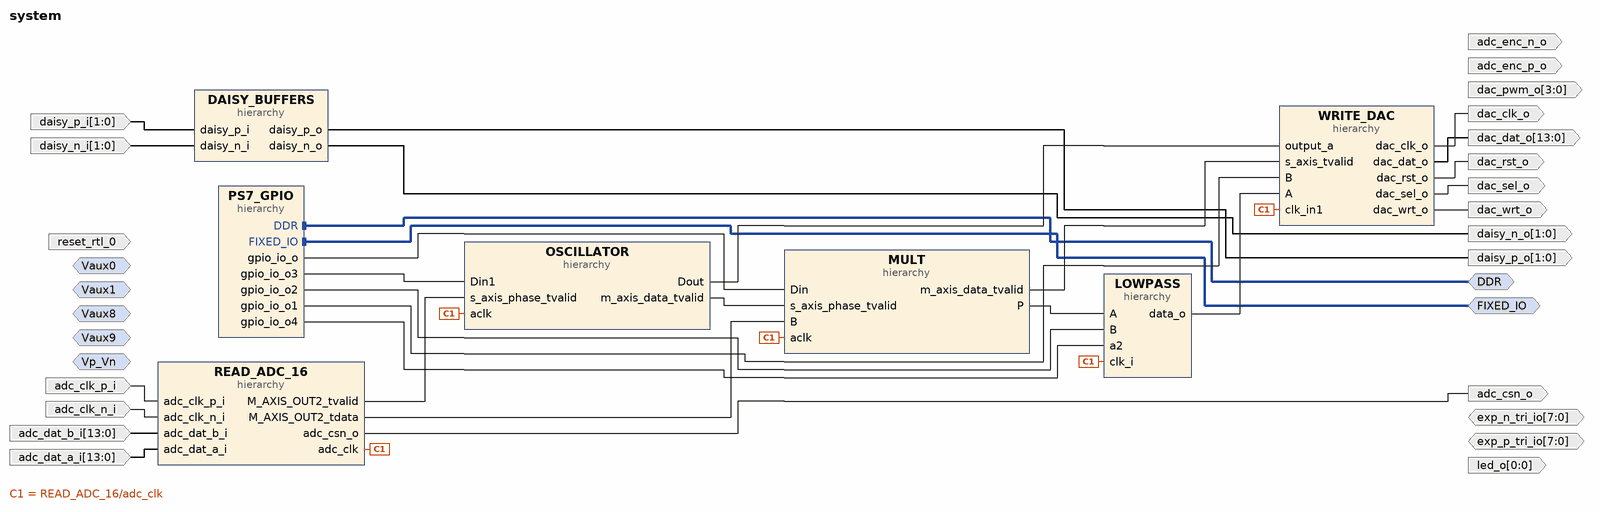
[diagram p0: block diagram of the top level]
# Vivado block design system, xc7z010clg400-1, Vivado 2018.2
create_bd_design system

create_bd_intf_port -mode Master -vlnv xilinx.com:interface:ddrx_rtl:1.0 DDR
create_bd_intf_port -mode Master -vlnv xilinx.com:display_processing_system7:fixedio_rtl:1.0 FIXED_IO
create_bd_intf_port -mode Slave -vlnv xilinx.com:interface:diff_analog_io_rtl:1.0 Vp_Vn
create_bd_intf_port -mode Slave -vlnv xilinx.com:interface:diff_analog_io_rtl:1.0 Vaux0
create_bd_intf_port -mode Slave -vlnv xilinx.com:interface:diff_analog_io_rtl:1.0 Vaux1
create_bd_intf_port -mode Slave -vlnv xilinx.com:interface:diff_analog_io_rtl:1.0 Vaux9
create_bd_intf_port -mode Slave -vlnv xilinx.com:interface:diff_analog_io_rtl:1.0 Vaux8
create_bd_port -dir O adc_enc_p_o
create_bd_port -dir O adc_enc_n_o
create_bd_port -dir O -from 3 -to 0 dac_pwm_o
create_bd_port -dir IO -from 7 -to 0 exp_p_tri_io
create_bd_port -dir IO -from 7 -to 0 exp_n_tri_io
create_bd_port -dir I -type rst reset_rtl_0
set_property -dict {CONFIG.POLARITY ACTIVE_HIGH} [get_bd_ports reset_rtl_0]
create_bd_port -dir O -from 0 -to 0 led_o
create_bd_port -dir I adc_clk_p_i
create_bd_port -dir I adc_clk_n_i
create_bd_port -dir I -from 1 -to 0 daisy_p_i
create_bd_port -dir I -from 1 -to 0 daisy_n_i
create_bd_port -dir O -from 1 -to 0 daisy_p_o
create_bd_port -dir O -from 1 -to 0 daisy_n_o
create_bd_port -dir O dac_clk_o
create_bd_port -dir O dac_rst_o
create_bd_port -dir O dac_sel_o
create_bd_port -dir O dac_wrt_o
create_bd_port -dir O -from 13 -to 0 dac_dat_o
create_bd_port -dir I -from 13 -to 0 adc_dat_b_i
create_bd_port -dir I -from 13 -to 0 adc_dat_a_i
create_bd_port -dir O adc_csn_o

create_bd_cell -type hier WRITE_DAC
create_bd_cell -type hier DAISY_BUFFERS
create_bd_cell -type hier PS7_GPIO
create_bd_cell -type hier READ_ADC_16
create_bd_cell -type hier MULT
create_bd_cell -type hier LOWPASS
create_bd_cell -type hier OSCILLATOR

# ---- hierarchy /WRITE_DAC ----
current_bd_instance /WRITE_DAC
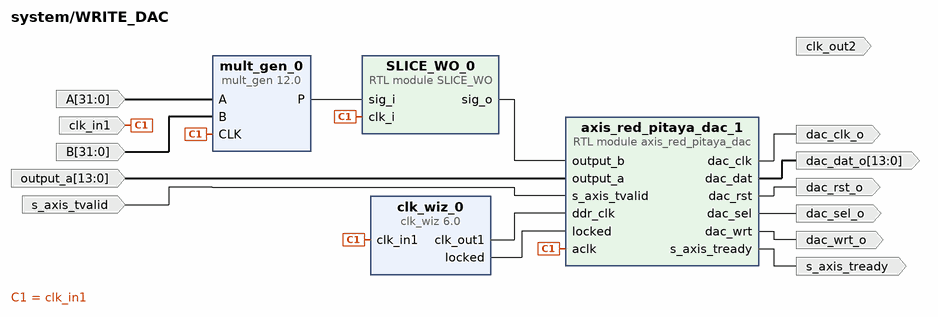
[diagram p1: block diagram inside /WRITE_DAC]
create_bd_pin -dir O -type clk dac_clk_o
create_bd_pin -dir O -type rst dac_rst_o
create_bd_pin -dir O dac_sel_o
create_bd_pin -dir O dac_wrt_o
create_bd_pin -dir O -from 13 -to 0 dac_dat_o
create_bd_pin -dir O s_axis_tready
create_bd_pin -dir I -from 13 -to 0 output_a
create_bd_pin -dir I s_axis_tvalid
create_bd_pin -dir O -type clk clk_out2
create_bd_pin -dir I -type clk clk_in1
create_bd_pin -dir I -from 31 -to 0 -type data A
create_bd_pin -dir I -from 31 -to 0 -type data B

create_bd_cell -type ip -vlnv xilinx.com:ip:clk_wiz:6.0 clk_wiz_0
set_property -dict [list \
  CONFIG.CLKOUT1_USED true \
  CONFIG.CLKOUT2_USED false \
  CONFIG.NUM_OUT_CLKS 1 \
  CONFIG.CLKOUT1_REQUESTED_OUT_FREQ 200 \
  CONFIG.CLKOUT2_REQUESTED_OUT_FREQ 200 \
  CONFIG.MMCM_DIVCLK_DIVIDE 1 \
  CONFIG.MMCM_CLKFBOUT_MULT_F 10.000 \
  CONFIG.MMCM_CLKOUT0_DIVIDE_F 5.000 \
  CONFIG.MMCM_CLKOUT1_DIVIDE 1 \
  CONFIG.CLKOUT1_JITTER 114.829 \
  CONFIG.CLKOUT1_PHASE_ERROR 98.575 \
  CONFIG.CLKOUT2_JITTER 209.588 \
  CONFIG.CLKOUT2_PHASE_ERROR 98.575 \
] [get_bd_cells clk_wiz_0]
create_bd_cell -type module -reference axis_red_pitaya_dac axis_red_pitaya_dac_1
create_bd_cell -type module -reference SLICE_WO SLICE_WO_0
create_bd_cell -type ip -vlnv xilinx.com:ip:mult_gen:12.0 mult_gen_0
set_property -dict [list \
  CONFIG.PortAType Signed \
  CONFIG.PortAWidth 32 \
  CONFIG.PortBType Signed \
  CONFIG.PortBWidth 32 \
  CONFIG.Multiplier_Construction Use_Mults \
  CONFIG.Use_Custom_Output_Width false \
  CONFIG.PipeStages 6 \
] [get_bd_cells mult_gen_0]

# ---- hierarchy /DAISY_BUFFERS ----
current_bd_instance /DAISY_BUFFERS
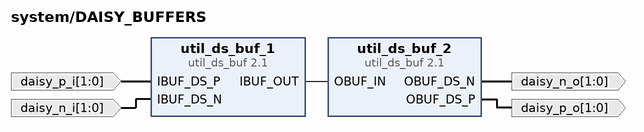
[diagram p2: block diagram inside /DAISY_BUFFERS]
create_bd_pin -dir I -from 1 -to 0 -type clk daisy_p_i
create_bd_pin -dir I -from 1 -to 0 -type clk daisy_n_i
create_bd_pin -dir O -from 1 -to 0 -type clk daisy_p_o
create_bd_pin -dir O -from 1 -to 0 -type clk daisy_n_o

create_bd_cell -type ip -vlnv xilinx.com:ip:util_ds_buf:2.1 util_ds_buf_1
set_property -dict {CONFIG.C_SIZE 2} [get_bd_cells util_ds_buf_1]
create_bd_cell -type ip -vlnv xilinx.com:ip:util_ds_buf:2.1 util_ds_buf_2
set_property -dict {CONFIG.C_SIZE 2 CONFIG.C_BUF_TYPE OBUFDS} [get_bd_cells util_ds_buf_2]

# ---- hierarchy /PS7_GPIO ----
current_bd_instance /PS7_GPIO
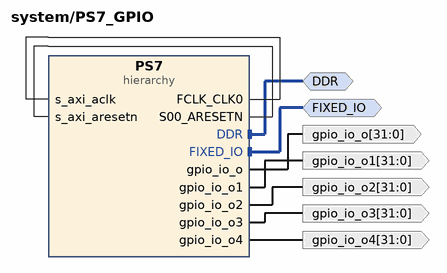
[diagram p3: block diagram inside /PS7_GPIO]
create_bd_intf_pin -mode Master -vlnv xilinx.com:interface:ddrx_rtl:1.0 DDR
create_bd_intf_pin -mode Master -vlnv xilinx.com:display_processing_system7:fixedio_rtl:1.0 FIXED_IO
create_bd_pin -dir O -from 31 -to 0 gpio_io_o
create_bd_pin -dir O -from 31 -to 0 gpio_io_o1
create_bd_pin -dir O -from 31 -to 0 gpio_io_o2
create_bd_pin -dir O -from 31 -to 0 gpio_io_o3
create_bd_pin -dir O -from 31 -to 0 gpio_io_o4

create_bd_cell -type hier PS7

# ---- hierarchy /PS7_GPIO/PS7 ----
current_bd_instance /PS7_GPIO/PS7
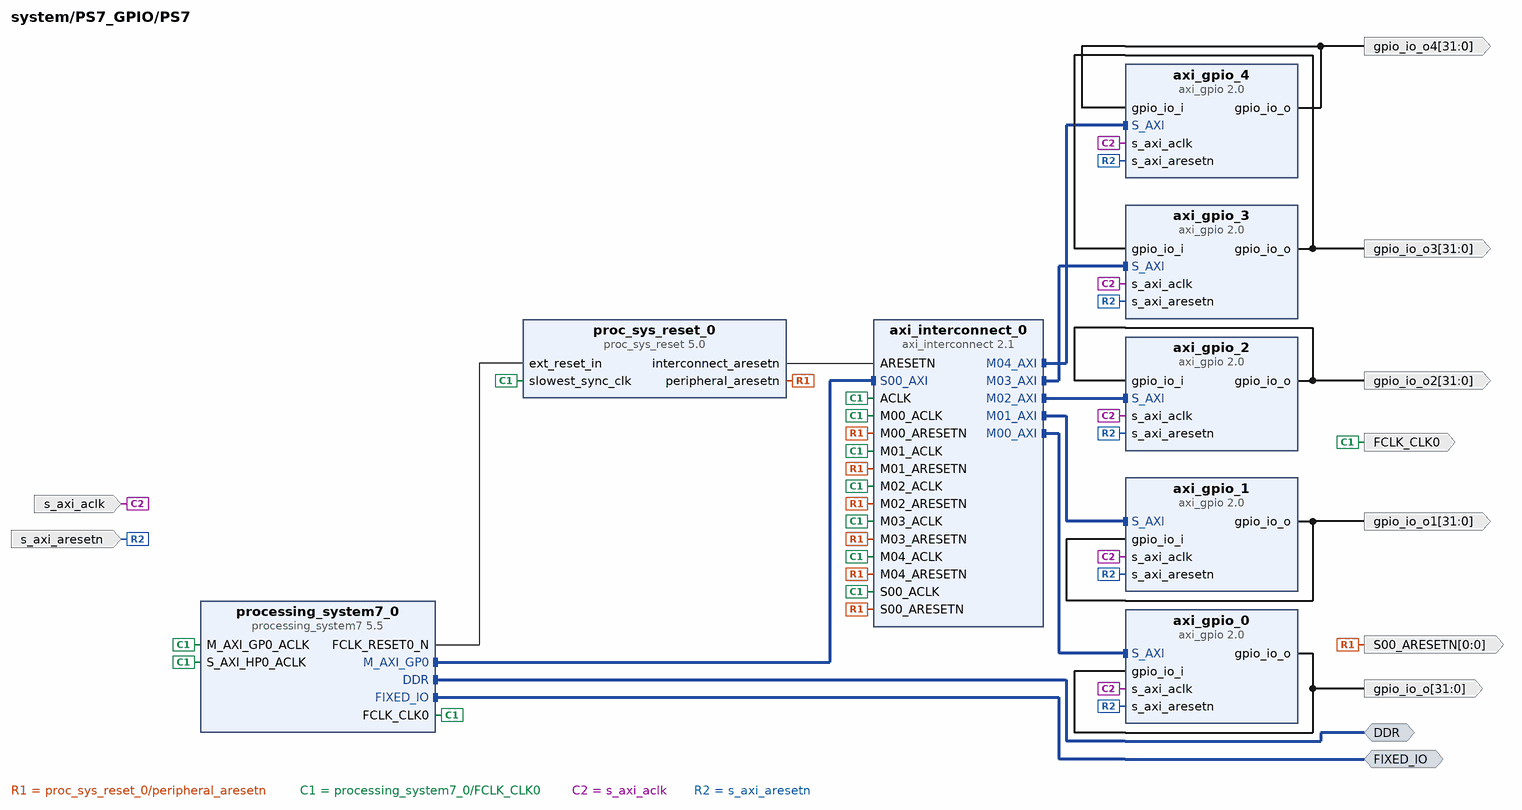
[diagram p4: block diagram inside /PS7_GPIO/PS7]
create_bd_intf_pin -mode Master -vlnv xilinx.com:interface:ddrx_rtl:1.0 DDR
create_bd_intf_pin -mode Master -vlnv xilinx.com:display_processing_system7:fixedio_rtl:1.0 FIXED_IO
create_bd_pin -dir O -type clk FCLK_CLK0
create_bd_pin -dir O -from 0 -to 0 -type rst S00_ARESETN
create_bd_pin -dir I -type clk s_axi_aclk
create_bd_pin -dir I -type rst s_axi_aresetn
create_bd_pin -dir O -from 31 -to 0 gpio_io_o
create_bd_pin -dir O -from 31 -to 0 gpio_io_o1
create_bd_pin -dir O -from 31 -to 0 gpio_io_o2
create_bd_pin -dir O -from 31 -to 0 gpio_io_o3
create_bd_pin -dir O -from 31 -to 0 gpio_io_o4

create_bd_cell -type ip -vlnv xilinx.com:ip:processing_system7:5.5 processing_system7_0
set_property -dict [list \
  CONFIG.PCW_UIPARAM_DDR_FREQ_MHZ 533.333333 \
  CONFIG.PCW_APU_PERIPHERAL_FREQMHZ 666.666666 \
  CONFIG.PCW_QSPI_PERIPHERAL_FREQMHZ 125 \
  CONFIG.PCW_SDIO_PERIPHERAL_FREQMHZ 100 \
  CONFIG.PCW_UART_PERIPHERAL_FREQMHZ 100 \
  CONFIG.PCW_I2C_PERIPHERAL_FREQMHZ 111.111115 \
  CONFIG.PCW_FPGA0_PERIPHERAL_FREQMHZ 125 \
  CONFIG.PCW_FPGA1_PERIPHERAL_FREQMHZ 250 \
  CONFIG.PCW_FPGA3_PERIPHERAL_FREQMHZ 200 \
  CONFIG.PCW_USE_S_AXI_HP0 1 \
  CONFIG.PCW_IMPORT_BOARD_PRESET cfg/red_pitaya.xml \
  CONFIG.PCW_PRESET_BANK1_VOLTAGE {LVCMOS 2.5V} \
  CONFIG.PCW_UIPARAM_DDR_BUS_WIDTH {16 Bit} \
  CONFIG.PCW_UIPARAM_DDR_PARTNO {MT41J256M16 RE-125} \
  CONFIG.PCW_QSPI_PERIPHERAL_ENABLE 1 \
  CONFIG.PCW_QSPI_QSPI_IO {MIO 1 .. 6} \
  CONFIG.PCW_QSPI_GRP_SINGLE_SS_ENABLE 1 \
  CONFIG.PCW_QSPI_GRP_SINGLE_SS_IO {MIO 1 .. 6} \
  CONFIG.PCW_SINGLE_QSPI_DATA_MODE x4 \
  CONFIG.PCW_ENET0_PERIPHERAL_ENABLE 1 \
  CONFIG.PCW_ENET0_ENET0_IO {MIO 16 .. 27} \
  CONFIG.PCW_ENET0_GRP_MDIO_ENABLE 1 \
  CONFIG.PCW_ENET0_GRP_MDIO_IO EMIO \
  CONFIG.PCW_ENET_RESET_ENABLE 1 \
  CONFIG.PCW_ENET_RESET_SELECT {Share reset pin} \
  CONFIG.PCW_ENET0_RESET_ENABLE 0 \
  CONFIG.PCW_SD0_PERIPHERAL_ENABLE 1 \
  CONFIG.PCW_SD0_SD0_IO {MIO 40 .. 45} \
  CONFIG.PCW_SD0_GRP_CD_ENABLE 1 \
  CONFIG.PCW_SD0_GRP_CD_IO {MIO 46} \
  CONFIG.PCW_SD0_GRP_WP_ENABLE 1 \
  CONFIG.PCW_SD0_GRP_WP_IO {MIO 47} \
  CONFIG.PCW_UART0_PERIPHERAL_ENABLE 1 \
  CONFIG.PCW_UART0_UART0_IO {MIO 14 .. 15} \
  CONFIG.PCW_UART1_PERIPHERAL_ENABLE 1 \
  CONFIG.PCW_UART1_UART1_IO {MIO 8 .. 9} \
  CONFIG.PCW_SPI0_PERIPHERAL_ENABLE 1 \
  CONFIG.PCW_SPI0_SPI0_IO EMIO \
  CONFIG.PCW_SPI1_PERIPHERAL_ENABLE 1 \
  CONFIG.PCW_SPI1_SPI1_IO {MIO 10 .. 15} \
  CONFIG.PCW_TTC0_PERIPHERAL_ENABLE 1 \
  CONFIG.PCW_TTC0_TTC0_IO EMIO \
  CONFIG.PCW_USB0_PERIPHERAL_ENABLE 1 \
  CONFIG.PCW_USB0_USB0_IO {MIO 28 .. 39} \
  CONFIG.PCW_USB_RESET_ENABLE 1 \
  CONFIG.PCW_USB_RESET_SELECT {Share reset pin} \
  CONFIG.PCW_USB0_RESET_ENABLE 1 \
  CONFIG.PCW_USB0_RESET_IO {MIO 48} \
  CONFIG.PCW_I2C0_PERIPHERAL_ENABLE 1 \
  CONFIG.PCW_I2C0_I2C0_IO {MIO 50 .. 51} \
  CONFIG.PCW_I2C0_GRP_INT_ENABLE 0 \
  CONFIG.PCW_I2C_RESET_ENABLE 1 \
  CONFIG.PCW_I2C_RESET_SELECT {Share reset pin} \
  CONFIG.PCW_GPIO_PERIPHERAL_ENABLE 1 \
  CONFIG.PCW_GPIO_MIO_GPIO_ENABLE 1 \
  CONFIG.PCW_GPIO_MIO_GPIO_IO MIO \
] [get_bd_cells processing_system7_0]
# 429 more settings of processing_system7_0 are not shown: defaults, MIO pin electricals, DDR timing, and values the tool derives
create_bd_cell -type ip -vlnv xilinx.com:ip:proc_sys_reset:5.0 proc_sys_reset_0
create_bd_cell -type ip -vlnv xilinx.com:ip:axi_interconnect:2.1 axi_interconnect_0
set_property -dict {CONFIG.NUM_MI 5 CONFIG.STRATEGY 2 CONFIG.S00_HAS_DATA_FIFO 2} [get_bd_cells axi_interconnect_0]
create_bd_cell -type ip -vlnv xilinx.com:ip:axi_gpio:2.0 axi_gpio_0
create_bd_cell -type ip -vlnv xilinx.com:ip:axi_gpio:2.0 axi_gpio_1
set_property -dict {CONFIG.C_DOUT_DEFAULT 0x00000001} [get_bd_cells axi_gpio_1]
create_bd_cell -type ip -vlnv xilinx.com:ip:axi_gpio:2.0 axi_gpio_2
set_property -dict {CONFIG.C_DOUT_DEFAULT 0x00000001} [get_bd_cells axi_gpio_2]
create_bd_cell -type ip -vlnv xilinx.com:ip:axi_gpio:2.0 axi_gpio_3
set_property -dict {CONFIG.C_DOUT_DEFAULT 0x00000053} [get_bd_cells axi_gpio_3]
create_bd_cell -type ip -vlnv xilinx.com:ip:axi_gpio:2.0 axi_gpio_4
set_property -dict {CONFIG.C_DOUT_DEFAULT 0x03823342} [get_bd_cells axi_gpio_4]

# ---- hierarchy /READ_ADC_16 ----
current_bd_instance /READ_ADC_16
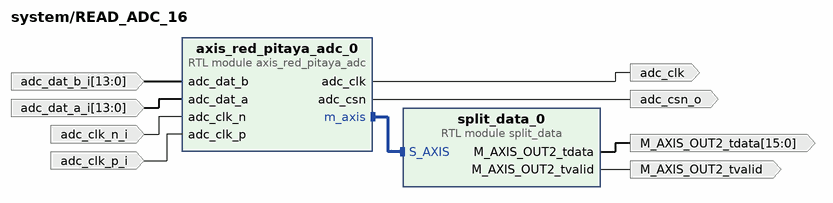
[diagram p5: block diagram inside /READ_ADC_16]
create_bd_pin -dir O adc_csn_o
create_bd_pin -dir I -type clk adc_clk_p_i
create_bd_pin -dir I -type clk adc_clk_n_i
create_bd_pin -dir I -from 13 -to 0 adc_dat_a_i
create_bd_pin -dir I -from 13 -to 0 adc_dat_b_i
create_bd_pin -dir O -type clk adc_clk
create_bd_pin -dir O M_AXIS_OUT2_tvalid
create_bd_pin -dir O -from 15 -to 0 -type data M_AXIS_OUT2_tdata

create_bd_cell -type module -reference axis_red_pitaya_adc axis_red_pitaya_adc_0
create_bd_cell -type module -reference split_data split_data_0

# ---- hierarchy /MULT ----
current_bd_instance /MULT
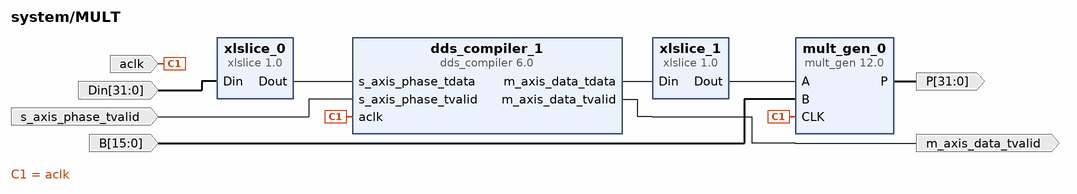
[diagram p6: block diagram inside /MULT]
create_bd_pin -dir I -type clk aclk
create_bd_pin -dir I s_axis_phase_tvalid
create_bd_pin -dir I -from 31 -to 0 Din
create_bd_pin -dir O -from 31 -to 0 -type data P
create_bd_pin -dir O m_axis_data_tvalid
create_bd_pin -dir I -from 15 -to 0 -type data B

create_bd_cell -type ip -vlnv xilinx.com:ip:dds_compiler:6.0 dds_compiler_1
set_property -dict [list \
  CONFIG.PartsPresent Phase_Generator_and_SIN_COS_LUT \
  CONFIG.DDS_Clock_Rate 100 \
  CONFIG.Channels 1 \
  CONFIG.Parameter_Entry Hardware_Parameters \
  CONFIG.Frequency_Resolution 0.4 \
  CONFIG.Noise_Shaping None \
  CONFIG.Phase_Width 16 \
  CONFIG.Output_Width 18 \
  CONFIG.Phase_offset Streaming \
  CONFIG.Output_Selection Sine \
  CONFIG.Optimization_Goal Speed \
  CONFIG.DSP48_Use Maximal \
  CONFIG.DATA_Has_TLAST Not_Required \
  CONFIG.Has_TREADY false \
  CONFIG.S_PHASE_Has_TUSER Not_Required \
  CONFIG.M_DATA_Has_TUSER Not_Required \
  CONFIG.M_PHASE_Has_TUSER Not_Required \
  CONFIG.Latency 10 \
  CONFIG.Output_Frequency1 0 \
  CONFIG.PINC1 100000 \
  CONFIG.POFF1 0 \
  CONFIG.PINC2 0 \
  CONFIG.POFF2 0 \
] [get_bd_cells dds_compiler_1]
create_bd_cell -type ip -vlnv xilinx.com:ip:xlslice:1.0 xlslice_0
set_property -dict {CONFIG.DIN_FROM 15 CONFIG.DOUT_WIDTH 16} [get_bd_cells xlslice_0]
create_bd_cell -type ip -vlnv xilinx.com:ip:xlslice:1.0 xlslice_1
set_property -dict {CONFIG.DIN_TO 0 CONFIG.DIN_FROM 17 CONFIG.DIN_WIDTH 24 CONFIG.DOUT_WIDTH 18} [get_bd_cells xlslice_1]
create_bd_cell -type ip -vlnv xilinx.com:ip:mult_gen:12.0 mult_gen_0
set_property -dict {CONFIG.PortBWidth 16 CONFIG.Use_Custom_Output_Width true CONFIG.OutputWidthHigh 31} [get_bd_cells mult_gen_0]

# ---- hierarchy /LOWPASS ----
current_bd_instance /LOWPASS
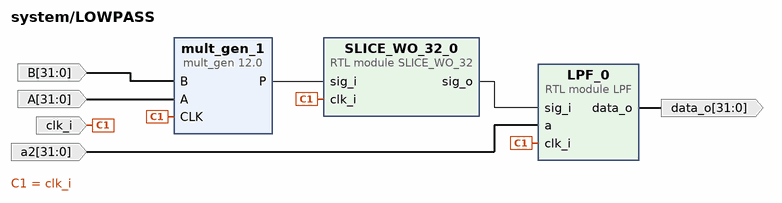
[diagram p7: block diagram inside /LOWPASS]
create_bd_pin -dir I clk_i
create_bd_pin -dir O -from 31 -to 0 data_o
create_bd_pin -dir I -from 31 -to 0 -type data A
create_bd_pin -dir I -from 31 -to 0 -type data B
create_bd_pin -dir I -from 31 -to 0 a2

create_bd_cell -type module -reference SLICE_WO_32 SLICE_WO_32_0
create_bd_cell -type ip -vlnv xilinx.com:ip:mult_gen:12.0 mult_gen_1
set_property -dict [list \
  CONFIG.PortAType Signed \
  CONFIG.PortAWidth 32 \
  CONFIG.PortBType Signed \
  CONFIG.PortBWidth 32 \
  CONFIG.Multiplier_Construction Use_Mults \
  CONFIG.Use_Custom_Output_Width false \
  CONFIG.PipeStages 6 \
] [get_bd_cells mult_gen_1]
create_bd_cell -type module -reference LPF LPF_0

# ---- hierarchy /OSCILLATOR ----
current_bd_instance /OSCILLATOR
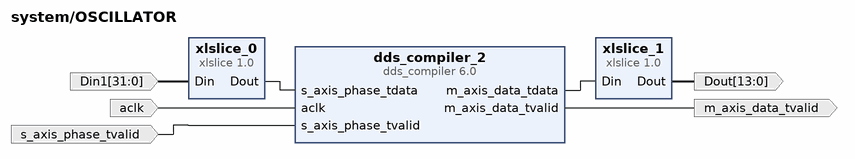
[diagram p8: block diagram inside /OSCILLATOR]
create_bd_pin -dir I -type clk aclk
create_bd_pin -dir O m_axis_data_tvalid
create_bd_pin -dir O -from 13 -to 0 Dout
create_bd_pin -dir I -from 31 -to 0 Din1
create_bd_pin -dir I s_axis_phase_tvalid

create_bd_cell -type ip -vlnv xilinx.com:ip:dds_compiler:6.0 dds_compiler_2
set_property -dict [list \
  CONFIG.PartsPresent Phase_Generator_and_SIN_COS_LUT \
  CONFIG.DDS_Clock_Rate 100 \
  CONFIG.Channels 1 \
  CONFIG.Parameter_Entry Hardware_Parameters \
  CONFIG.Frequency_Resolution 0.4 \
  CONFIG.Noise_Shaping None \
  CONFIG.Phase_Width 24 \
  CONFIG.Output_Width 14 \
  CONFIG.Phase_Increment Streaming \
  CONFIG.Resync false \
  CONFIG.Phase_offset None \
  CONFIG.Output_Selection Sine \
  CONFIG.Optimization_Goal Speed \
  CONFIG.DSP48_Use Maximal \
  CONFIG.Has_Phase_Out false \
  CONFIG.DATA_Has_TLAST Not_Required \
  CONFIG.Has_TREADY false \
  CONFIG.S_PHASE_Has_TUSER Not_Required \
  CONFIG.M_DATA_Has_TUSER Not_Required \
  CONFIG.M_PHASE_Has_TUSER Not_Required \
  CONFIG.Latency 9 \
  CONFIG.Output_Frequency1 0 \
  CONFIG.PINC1 0 \
  CONFIG.POFF1 0 \
  CONFIG.PINC2 0 \
  CONFIG.POFF2 0 \
] [get_bd_cells dds_compiler_2]
create_bd_cell -type ip -vlnv xilinx.com:ip:xlslice:1.0 xlslice_1
set_property -dict {CONFIG.DIN_TO 0 CONFIG.DIN_FROM 13 CONFIG.DIN_WIDTH 16 CONFIG.DOUT_WIDTH 14} [get_bd_cells xlslice_1]
create_bd_cell -type ip -vlnv xilinx.com:ip:xlslice:1.0 xlslice_0
set_property -dict {CONFIG.DIN_FROM 23 CONFIG.DOUT_WIDTH 24} [get_bd_cells xlslice_0]

# ---- connections ----

current_bd_instance /WRITE_DAC
connect_bd_net -net processing_system7_0_FCLK_CLK1 [get_bd_pins clk_in1] \
  [get_bd_pins clk_wiz_0/clk_in1] [get_bd_pins axis_red_pitaya_dac_1/aclk] [get_bd_pins SLICE_WO_0/clk_i] \
  [get_bd_pins mult_gen_0/CLK]
connect_bd_net [get_bd_pins axis_red_pitaya_dac_1/dac_clk] [get_bd_pins dac_clk_o]
connect_bd_net [get_bd_pins axis_red_pitaya_dac_1/dac_rst] [get_bd_pins dac_rst_o]
connect_bd_net [get_bd_pins axis_red_pitaya_dac_1/dac_sel] [get_bd_pins dac_sel_o]
connect_bd_net [get_bd_pins axis_red_pitaya_dac_1/dac_wrt] [get_bd_pins dac_wrt_o]
connect_bd_net [get_bd_pins axis_red_pitaya_dac_1/dac_dat] [get_bd_pins dac_dat_o]
connect_bd_net [get_bd_pins axis_red_pitaya_dac_1/s_axis_tready] [get_bd_pins s_axis_tready]
connect_bd_net -net dds_compiler_0_m_axis_data_tdata [get_bd_pins output_a] [get_bd_pins axis_red_pitaya_dac_1/output_a]
connect_bd_net -net dds_compiler_0_m_axis_data_tvalid [get_bd_pins s_axis_tvalid] [get_bd_pins axis_red_pitaya_dac_1/s_axis_tvalid]
connect_bd_net [get_bd_pins clk_wiz_0/clk_out1] [get_bd_pins axis_red_pitaya_dac_1/ddr_clk]
connect_bd_net [get_bd_pins clk_wiz_0/locked] [get_bd_pins axis_red_pitaya_dac_1/locked]
connect_bd_net [get_bd_pins SLICE_WO_0/sig_o] [get_bd_pins axis_red_pitaya_dac_1/output_b]
connect_bd_net [get_bd_pins A] [get_bd_pins mult_gen_0/A]
connect_bd_net [get_bd_pins B] [get_bd_pins mult_gen_0/B]
connect_bd_net [get_bd_pins mult_gen_0/P] [get_bd_pins SLICE_WO_0/sig_i]

current_bd_instance /DAISY_BUFFERS
connect_bd_net [get_bd_pins util_ds_buf_1/IBUF_OUT] [get_bd_pins util_ds_buf_2/OBUF_IN]
connect_bd_net [get_bd_pins daisy_p_i] [get_bd_pins util_ds_buf_1/IBUF_DS_P]
connect_bd_net [get_bd_pins daisy_n_i] [get_bd_pins util_ds_buf_1/IBUF_DS_N]
connect_bd_net [get_bd_pins util_ds_buf_2/OBUF_DS_P] [get_bd_pins daisy_p_o]
connect_bd_net [get_bd_pins util_ds_buf_2/OBUF_DS_N] [get_bd_pins daisy_n_o]

current_bd_instance /PS7_GPIO
connect_bd_intf_net -intf_net processing_system7_0_DDR [get_bd_intf_pins DDR] [get_bd_intf_pins PS7/DDR]
connect_bd_intf_net -intf_net processing_system7_0_FIXED_IO [get_bd_intf_pins FIXED_IO] [get_bd_intf_pins PS7/FIXED_IO]
connect_bd_net [get_bd_pins PS7/FCLK_CLK0] [get_bd_pins PS7/s_axi_aclk]
connect_bd_net [get_bd_pins PS7/S00_ARESETN] [get_bd_pins PS7/s_axi_aresetn]
connect_bd_net [get_bd_pins PS7/gpio_io_o] [get_bd_pins gpio_io_o]
connect_bd_net [get_bd_pins PS7/gpio_io_o1] [get_bd_pins gpio_io_o1]
connect_bd_net [get_bd_pins PS7/gpio_io_o2] [get_bd_pins gpio_io_o2]
connect_bd_net [get_bd_pins PS7/gpio_io_o3] [get_bd_pins gpio_io_o3]
connect_bd_net [get_bd_pins PS7/gpio_io_o4] [get_bd_pins gpio_io_o4]

current_bd_instance /PS7_GPIO/PS7
connect_bd_intf_net [get_bd_intf_pins axi_interconnect_0/S00_AXI] [get_bd_intf_pins processing_system7_0/M_AXI_GP0]
connect_bd_intf_net [get_bd_intf_pins axi_interconnect_0/M00_AXI] [get_bd_intf_pins axi_gpio_0/S_AXI]
connect_bd_intf_net [get_bd_intf_pins axi_interconnect_0/M01_AXI] [get_bd_intf_pins axi_gpio_1/S_AXI]
connect_bd_intf_net [get_bd_intf_pins axi_interconnect_0/M02_AXI] [get_bd_intf_pins axi_gpio_2/S_AXI]
connect_bd_intf_net [get_bd_intf_pins axi_gpio_3/S_AXI] [get_bd_intf_pins axi_interconnect_0/M03_AXI]
connect_bd_intf_net [get_bd_intf_pins axi_interconnect_0/M04_AXI] [get_bd_intf_pins axi_gpio_4/S_AXI]
connect_bd_intf_net [get_bd_intf_pins DDR] [get_bd_intf_pins processing_system7_0/DDR]
connect_bd_intf_net [get_bd_intf_pins FIXED_IO] [get_bd_intf_pins processing_system7_0/FIXED_IO]
connect_bd_net [get_bd_pins processing_system7_0/FCLK_RESET0_N] [get_bd_pins proc_sys_reset_0/ext_reset_in]
connect_bd_net [get_bd_pins proc_sys_reset_0/interconnect_aresetn] [get_bd_pins axi_interconnect_0/ARESETN]
connect_bd_net [get_bd_pins proc_sys_reset_0/peripheral_aresetn] \
  [get_bd_pins S00_ARESETN] [get_bd_pins axi_interconnect_0/M00_ARESETN] [get_bd_pins axi_interconnect_0/S00_ARESETN] \
  [get_bd_pins axi_interconnect_0/M01_ARESETN] [get_bd_pins axi_interconnect_0/M02_ARESETN] \
  [get_bd_pins axi_interconnect_0/M03_ARESETN] [get_bd_pins axi_interconnect_0/M04_ARESETN]
connect_bd_net [get_bd_pins processing_system7_0/FCLK_CLK0] \
  [get_bd_pins FCLK_CLK0] [get_bd_pins processing_system7_0/S_AXI_HP0_ACLK] [get_bd_pins proc_sys_reset_0/slowest_sync_clk] \
  [get_bd_pins processing_system7_0/M_AXI_GP0_ACLK] [get_bd_pins axi_interconnect_0/S00_ACLK] \
  [get_bd_pins axi_interconnect_0/M00_ACLK] [get_bd_pins axi_interconnect_0/ACLK] [get_bd_pins axi_interconnect_0/M01_ACLK] \
  [get_bd_pins axi_interconnect_0/M02_ACLK] [get_bd_pins axi_interconnect_0/M04_ACLK] \
  [get_bd_pins axi_interconnect_0/M03_ACLK]
connect_bd_net [get_bd_pins s_axi_aclk] \
  [get_bd_pins axi_gpio_0/s_axi_aclk] [get_bd_pins axi_gpio_1/s_axi_aclk] [get_bd_pins axi_gpio_2/s_axi_aclk] \
  [get_bd_pins axi_gpio_3/s_axi_aclk] [get_bd_pins axi_gpio_4/s_axi_aclk]
connect_bd_net [get_bd_pins s_axi_aresetn] \
  [get_bd_pins axi_gpio_0/s_axi_aresetn] [get_bd_pins axi_gpio_1/s_axi_aresetn] [get_bd_pins axi_gpio_2/s_axi_aresetn] \
  [get_bd_pins axi_gpio_3/s_axi_aresetn] [get_bd_pins axi_gpio_4/s_axi_aresetn]
connect_bd_net [get_bd_pins axi_gpio_0/gpio_io_o] [get_bd_pins gpio_io_o] [get_bd_pins axi_gpio_0/gpio_io_i]
connect_bd_net [get_bd_pins axi_gpio_1/gpio_io_o] [get_bd_pins gpio_io_o1] [get_bd_pins axi_gpio_1/gpio_io_i]
connect_bd_net [get_bd_pins axi_gpio_2/gpio_io_o] [get_bd_pins gpio_io_o2] [get_bd_pins axi_gpio_2/gpio_io_i]
connect_bd_net [get_bd_pins axi_gpio_3/gpio_io_o] [get_bd_pins gpio_io_o3] [get_bd_pins axi_gpio_3/gpio_io_i]
connect_bd_net [get_bd_pins axi_gpio_4/gpio_io_o] [get_bd_pins gpio_io_o4] [get_bd_pins axi_gpio_4/gpio_io_i]

current_bd_instance /READ_ADC_16
connect_bd_intf_net [get_bd_intf_pins split_data_0/S_AXIS] [get_bd_intf_pins axis_red_pitaya_adc_0/m_axis]
connect_bd_net [get_bd_pins adc_dat_b_i] [get_bd_pins axis_red_pitaya_adc_0/adc_dat_b]
connect_bd_net [get_bd_pins adc_dat_a_i] [get_bd_pins axis_red_pitaya_adc_0/adc_dat_a]
connect_bd_net [get_bd_pins adc_clk_n_i] [get_bd_pins axis_red_pitaya_adc_0/adc_clk_n]
connect_bd_net [get_bd_pins adc_clk_p_i] [get_bd_pins axis_red_pitaya_adc_0/adc_clk_p]
connect_bd_net [get_bd_pins axis_red_pitaya_adc_0/adc_csn] [get_bd_pins adc_csn_o]
connect_bd_net [get_bd_pins axis_red_pitaya_adc_0/adc_clk] [get_bd_pins adc_clk]
connect_bd_net [get_bd_pins split_data_0/M_AXIS_OUT2_tvalid] [get_bd_pins M_AXIS_OUT2_tvalid]
connect_bd_net [get_bd_pins split_data_0/M_AXIS_OUT2_tdata] [get_bd_pins M_AXIS_OUT2_tdata]

current_bd_instance /MULT
connect_bd_net -net processing_system7_0_FCLK_CLK1 [get_bd_pins aclk] [get_bd_pins dds_compiler_1/aclk] [get_bd_pins mult_gen_0/CLK]
connect_bd_net [get_bd_pins s_axis_phase_tvalid] [get_bd_pins dds_compiler_1/s_axis_phase_tvalid]
connect_bd_net [get_bd_pins xlslice_0/Dout] [get_bd_pins dds_compiler_1/s_axis_phase_tdata]
connect_bd_net [get_bd_pins Din] [get_bd_pins xlslice_0/Din]
connect_bd_net [get_bd_pins dds_compiler_1/m_axis_data_tdata] [get_bd_pins xlslice_1/Din]
connect_bd_net [get_bd_pins mult_gen_0/P] [get_bd_pins P]
connect_bd_net [get_bd_pins xlslice_1/Dout] [get_bd_pins mult_gen_0/A]
connect_bd_net [get_bd_pins dds_compiler_1/m_axis_data_tvalid] [get_bd_pins m_axis_data_tvalid]
connect_bd_net [get_bd_pins B] [get_bd_pins mult_gen_0/B]

current_bd_instance /LOWPASS
connect_bd_net -net processing_system7_0_FCLK_CLK1 [get_bd_pins clk_i] \
  [get_bd_pins SLICE_WO_32_0/clk_i] [get_bd_pins mult_gen_1/CLK] [get_bd_pins LPF_0/clk_i]
connect_bd_net [get_bd_pins LPF_0/data_o] [get_bd_pins data_o]
connect_bd_net [get_bd_pins SLICE_WO_32_0/sig_o] [get_bd_pins LPF_0/sig_i]
connect_bd_net -net a2_1 [get_bd_pins a2] [get_bd_pins LPF_0/a]
connect_bd_net [get_bd_pins mult_gen_1/P] [get_bd_pins SLICE_WO_32_0/sig_i]
connect_bd_net [get_bd_pins B] [get_bd_pins mult_gen_1/B]
connect_bd_net [get_bd_pins A] [get_bd_pins mult_gen_1/A]

current_bd_instance /OSCILLATOR
connect_bd_net [get_bd_pins dds_compiler_2/m_axis_data_tdata] [get_bd_pins xlslice_1/Din]
connect_bd_net -net processing_system7_0_FCLK_CLK1 [get_bd_pins aclk] [get_bd_pins dds_compiler_2/aclk]
connect_bd_net [get_bd_pins xlslice_1/Dout] [get_bd_pins Dout]
connect_bd_net [get_bd_pins xlslice_0/Dout] [get_bd_pins dds_compiler_2/s_axis_phase_tdata]
connect_bd_net -net Din1_1 [get_bd_pins Din1] [get_bd_pins xlslice_0/Din]
connect_bd_net [get_bd_pins dds_compiler_2/m_axis_data_tvalid] [get_bd_pins m_axis_data_tvalid]
connect_bd_net [get_bd_pins s_axis_phase_tvalid] [get_bd_pins dds_compiler_2/s_axis_phase_tvalid]

current_bd_instance /
connect_bd_intf_net -intf_net processing_system7_0_DDR [get_bd_intf_ports DDR] [get_bd_intf_pins PS7_GPIO/DDR]
connect_bd_intf_net -intf_net processing_system7_0_FIXED_IO [get_bd_intf_ports FIXED_IO] [get_bd_intf_pins PS7_GPIO/FIXED_IO]
connect_bd_net [get_bd_ports adc_clk_p_i] [get_bd_pins READ_ADC_16/adc_clk_p_i]
connect_bd_net [get_bd_ports adc_clk_n_i] [get_bd_pins READ_ADC_16/adc_clk_n_i]
connect_bd_net [get_bd_ports daisy_p_i] [get_bd_pins DAISY_BUFFERS/daisy_p_i]
connect_bd_net [get_bd_ports daisy_n_i] [get_bd_pins DAISY_BUFFERS/daisy_n_i]
connect_bd_net -net util_ds_buf_2_OBUF_DS_P [get_bd_pins DAISY_BUFFERS/daisy_p_o] [get_bd_ports daisy_p_o]
connect_bd_net -net util_ds_buf_2_OBUF_DS_N [get_bd_pins DAISY_BUFFERS/daisy_n_o] [get_bd_ports daisy_n_o]
connect_bd_net -net axis_red_pitaya_dac_1_dac_clk [get_bd_pins WRITE_DAC/dac_clk_o] [get_bd_ports dac_clk_o]
connect_bd_net -net axis_red_pitaya_dac_1_dac_rst [get_bd_pins WRITE_DAC/dac_rst_o] [get_bd_ports dac_rst_o]
connect_bd_net -net axis_red_pitaya_dac_1_dac_sel [get_bd_pins WRITE_DAC/dac_sel_o] [get_bd_ports dac_sel_o]
connect_bd_net -net axis_red_pitaya_dac_1_dac_wrt [get_bd_pins WRITE_DAC/dac_wrt_o] [get_bd_ports dac_wrt_o]
connect_bd_net -net axis_red_pitaya_dac_1_dac_dat [get_bd_pins WRITE_DAC/dac_dat_o] [get_bd_ports dac_dat_o]
connect_bd_net [get_bd_ports adc_dat_b_i] [get_bd_pins READ_ADC_16/adc_dat_b_i]
connect_bd_net [get_bd_ports adc_dat_a_i] [get_bd_pins READ_ADC_16/adc_dat_a_i]
connect_bd_net -net axis_red_pitaya_adc_0_adc_csn [get_bd_pins READ_ADC_16/adc_csn_o] [get_bd_ports adc_csn_o]
connect_bd_net -net processing_system7_0_FCLK_CLK1 [get_bd_pins READ_ADC_16/adc_clk] \
  [get_bd_pins WRITE_DAC/clk_in1] [get_bd_pins MULT/aclk] [get_bd_pins LOWPASS/clk_i] [get_bd_pins OSCILLATOR/aclk]
connect_bd_net -net xlslice_1_Dout [get_bd_pins OSCILLATOR/Dout] [get_bd_pins WRITE_DAC/output_a]
connect_bd_net [get_bd_pins PS7_GPIO/gpio_io_o2] [get_bd_pins LOWPASS/B]
connect_bd_net [get_bd_pins LOWPASS/data_o] [get_bd_pins WRITE_DAC/A]
connect_bd_net [get_bd_pins PS7_GPIO/gpio_io_o1] [get_bd_pins WRITE_DAC/B]
connect_bd_net [get_bd_pins PS7_GPIO/gpio_io_o] [get_bd_pins MULT/Din]
connect_bd_net -net A_1 [get_bd_pins MULT/P] [get_bd_pins LOWPASS/A]
connect_bd_net -net Din1_1 [get_bd_pins PS7_GPIO/gpio_io_o3] [get_bd_pins OSCILLATOR/Din1]
connect_bd_net -net a2_1 [get_bd_pins PS7_GPIO/gpio_io_o4] [get_bd_pins LOWPASS/a2]
connect_bd_net [get_bd_pins OSCILLATOR/m_axis_data_tvalid] [get_bd_pins MULT/s_axis_phase_tvalid]
connect_bd_net -net s_axis_tvalid_1 [get_bd_pins MULT/m_axis_data_tvalid] [get_bd_pins WRITE_DAC/s_axis_tvalid]
connect_bd_net -net s_axis_phase_tvalid_1 [get_bd_pins READ_ADC_16/M_AXIS_OUT2_tvalid] [get_bd_pins OSCILLATOR/s_axis_phase_tvalid]
connect_bd_net [get_bd_pins READ_ADC_16/M_AXIS_OUT2_tdata] [get_bd_pins MULT/B]

# ---- address map ----
assign_bd_address -offset 0x41200000 -range 4K -target_address_space [get_bd_addr_spaces PS7_GPIO/PS7/processing_system7_0/Data] [get_bd_addr_segs PS7_GPIO/PS7/axi_gpio_0/S_AXI/Reg]
assign_bd_address -offset 0x41210000 -range 4K -target_address_space [get_bd_addr_spaces PS7_GPIO/PS7/processing_system7_0/Data] [get_bd_addr_segs PS7_GPIO/PS7/axi_gpio_1/S_AXI/Reg]
assign_bd_address -offset 0x41220000 -range 4K -target_address_space [get_bd_addr_spaces PS7_GPIO/PS7/processing_system7_0/Data] [get_bd_addr_segs PS7_GPIO/PS7/axi_gpio_2/S_AXI/Reg]
assign_bd_address -offset 0x41230000 -range 4K -target_address_space [get_bd_addr_spaces PS7_GPIO/PS7/processing_system7_0/Data] [get_bd_addr_segs PS7_GPIO/PS7/axi_gpio_3/S_AXI/Reg]
assign_bd_address -offset 0x41240000 -range 4K -target_address_space [get_bd_addr_spaces PS7_GPIO/PS7/processing_system7_0/Data] [get_bd_addr_segs PS7_GPIO/PS7/axi_gpio_4/S_AXI/Reg]

validate_bd_design
save_bd_design
